# EAGLE design esp-12-f-breakout-ch340t (EAGLE 7.5.0)
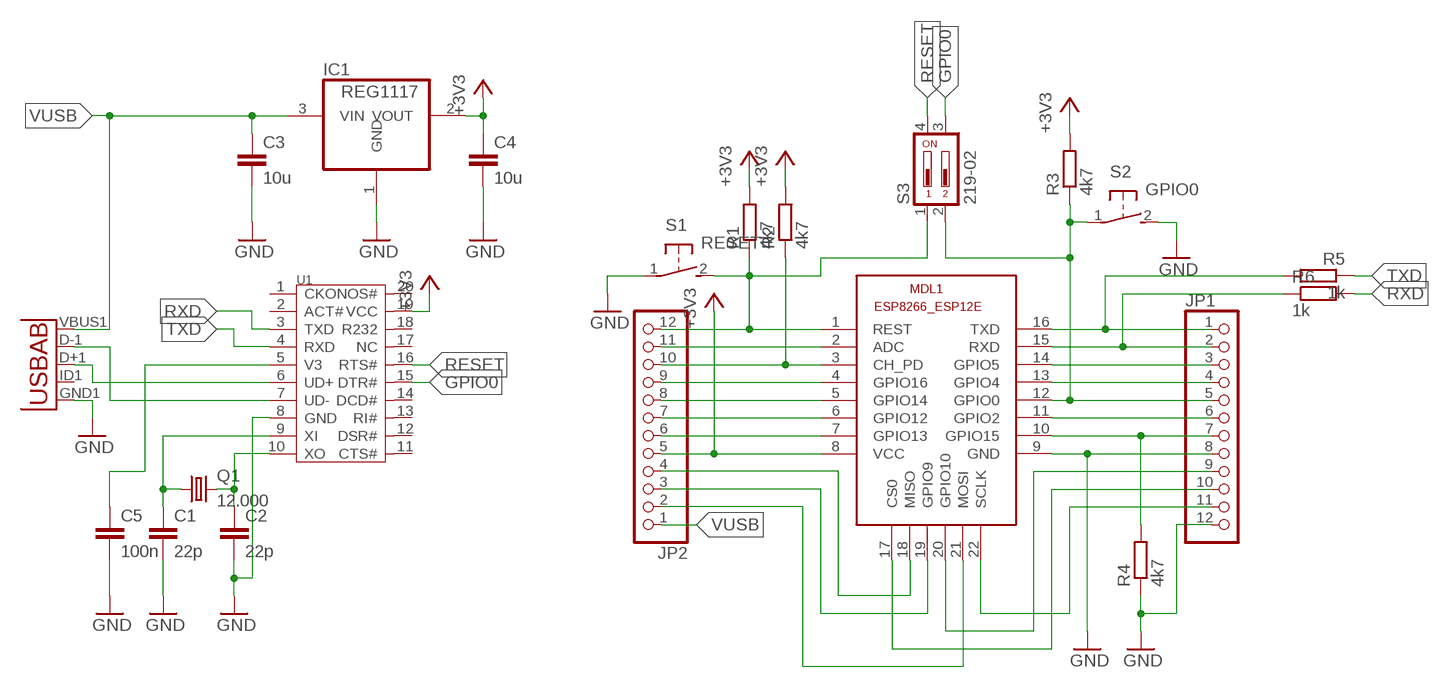
[diagram p0: schematic, sheet 1]

## Parts
C1  22p  C-EUC0805  [C0805]
C2  22p  C-EUC0805  [C0805]
C3  10u  C-EUC0805  [C0805]
C4  10u  C-EUC0805  [C0805]
C5  100n  C-EUC0805  [C0805]
IC1  REG1117  [SOT223]
JP1  PINHD-1X12  [1X12]
JP2  PINHD-1X12  [1X12]
MDL1  ESP8266-12EESP8266-ESP12E  [ESP8266-ESP12E]
Q1  12.000  CRYSTALHC49UP  [HC49UP]
R1  4k7  R-EU_M0805  [M0805]
R2  4k7  R-EU_M0805  [M0805]
R3  4k7  R-EU_M0805  [M0805]
R4  4k7  R-EU_M0805  [M0805]
R5  1k  R-EU_M0805  [M0805]
R6  1k  R-EU_M0805  [M0805]
S1  RESET  DTSM-3  [DTSM-3]
S2  GPIO0  DTSM-3  [DTSM-3]
S3  219-02  [CTS-219-02]
U1  CH340T  [SSOP20]
U2  USB""  [USB-MICRO-SMD]

## Nets
+3V3: C4.1 IC1.2(VOUT) JP2.5 MDL1.8(VCC) R1.2 R2.2 R3.2 U1.19(VCC)
GND: C1.2 C2.2 C3.2 C4.2 C5.2 IC1.1(GND) JP1.8 JP1.12 MDL1.9(GND) R4.1 S1.1 S2.2 U1.8(GND) U2.GND1(GND)
GPIO0: S3.3 U1.15(DTR#)
N$1: JP2.12 MDL1.1(REST) R1.1 S1.2 S3.1
N$2: JP2.11 MDL1.2(ADC)
N$3: JP2.10 MDL1.3(CH_PD) R2.1
N$4: JP2.9 MDL1.4(GPIO16)
N$5: JP2.8 MDL1.5(GPIO14)
N$6: JP2.7 MDL1.6(GPIO12)
N$7: JP2.6 MDL1.7(GPIO13)
N$8: JP2.4 MDL1.18(MISO)
N$11: JP2.3 MDL1.19(GPIO9)
N$12: JP1.9 MDL1.20(GPIO10)
N$13: JP1.10 MDL1.17(CS0)
N$14: JP1.11 MDL1.22(SCLK)
N$15: JP2.2 MDL1.21(MOSI)
N$16: JP1.7 MDL1.10(GPIO15) R4.2
N$17: JP1.6 MDL1.11(GPIO2)
N$18: JP1.5 MDL1.12(GPIO0) R3.1 S2.1 S3.2
N$19: JP1.4 MDL1.13(GPIO4)
N$20: JP1.3 MDL1.14(GPIO5)
N$21: JP1.2 MDL1.15(RXD) R6.1
N$22: JP1.1 MDL1.16(TXD) R5.2
N$23: C1.1 Q1.1 U1.9(XI)
N$24: C2.1 Q1.2 U1.10(XO)
N$25: U1.7(UD-) U2.D-1(D-)
N$26: U1.6(UD+) U2.D+1(D+)
RESET: S3.4 U1.16(RTS#)
RXD: R6.2 U1.3(TXD)
TXD: R5.1 U1.4(RXD)
V3: C5.1 U1.5(V3)
VUSB: C3.1 IC1.3(VIN) JP2.1 U2.VBUS1(VBUS)
Unconnected: U1.1(CKO) U1.2(ACT#) U1.11(CTS#) U1.12(DSR#) U1.13(RI#) U1.14(DCD#) U1.17(NC) U1.18(R232) U1.20(NOS#) U2.ID1(USBID)

## Library data of the parts
C1-C5 = rcl:C-EU: CAPACITOR, European symbol
IC1 = burr-brown:REG1117: 800mA and 1A Low Dropout (LDO) Positive Regulator 1.8V, 2.5V, 2.85V, 3.3V, 5V, and Adj; MPN: REG1117; OC_FARNELL: 1097566; OC_NEWARK: 14P6981
JP1 JP2 = pinhead:PINHD-1X12: PIN HEADER
MDL1 = ESP8266-ESP12E:ESP8266-12E: ESP8266-12E with additional I/O and GPIO04/05 corrected The author cannot warrant that this library is free from error or will meet your specific requirements. Created by PuceBaboon.com. Komagane, Nagano, JAPAN
Q1 = crystal:CRYSTAL: CRYSTAL; OC_FARNELL: unknown; OC_NEWARK: unknown
R1-R6 = rcl:R-EU_: RESISTOR, European symbol
S1 S2 = switch-tact:DTSM-3
S3 = switch-dil:219-02*: Surface Mount DIP Switch Series 219 SMT CTS Electronic Components Sourc: www.ctscorp.com; OC_FARNELL: unknown; OC_NEWARK: unknown
U1 = template:CH340T
U2 = MicroUSB:USB: This is a USB AB connector that is compatible with USB OTG. i.e. this connector can serve as a host or device

## Net classes
0 default: width 0.305 mm, clearance 0.254 mm

## Board
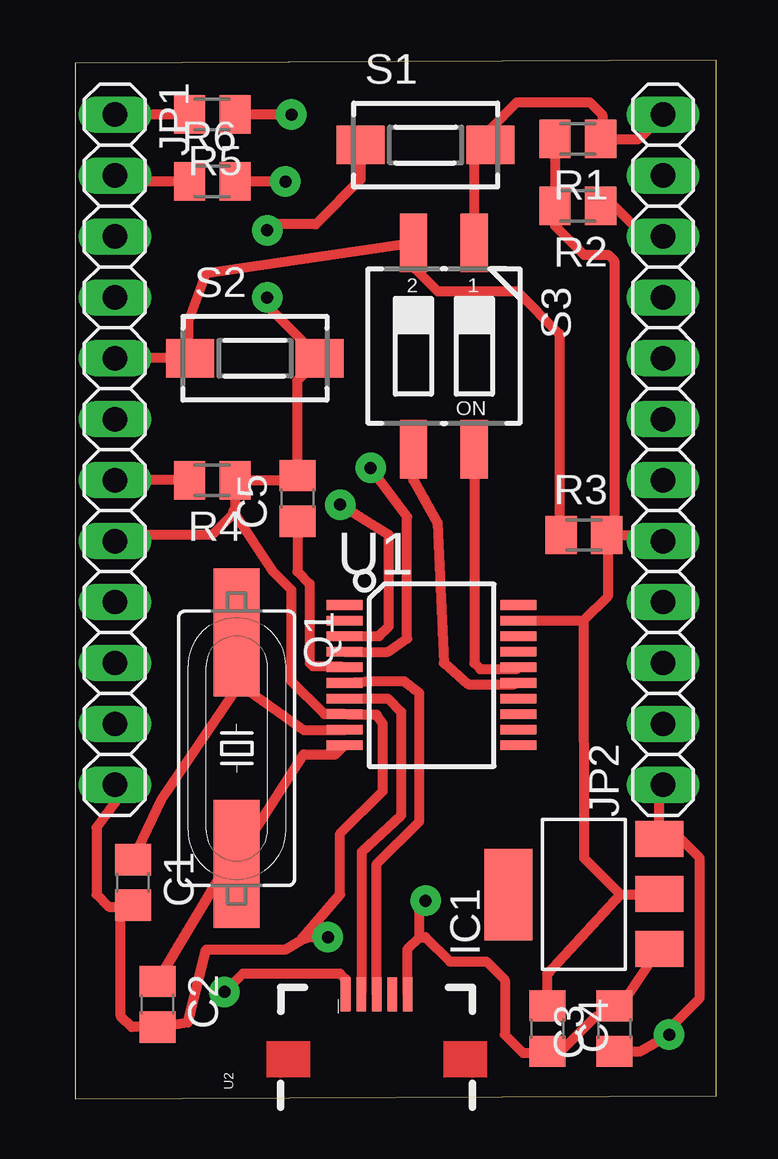
[diagram p1: board, top side]
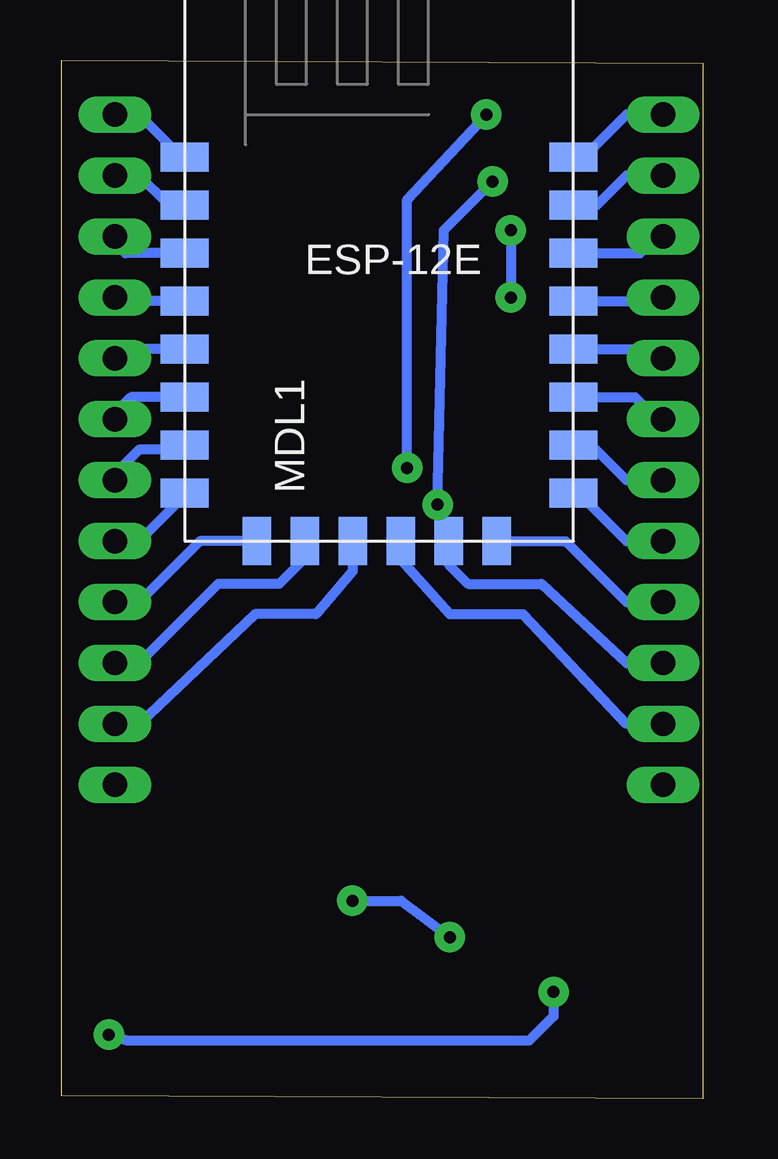
[diagram p2: board, bottom side, seen from below]

Size 26.72 x 43.3 mm. Coordinates in mm from the lower left corner, seen from the top.
Outline: 0,0 26.72,0.13 26.72,43.3 0,43.17 0,0
Copper layers (1*16): Top 0.035mm / dielectric 1.5mm / Bottom 0.035mm
Design rules "default": minimum track width 10mil, minimum drill 24mil, track to track 8mil, track to pad 8mil, pad to pad 8mil, via to via 8mil, smd to smd 8mil, copper to edge 40mil, drill to drill 8mil, minimum pad ring 10mil, minimum via ring 8mil, stop-mask expansion 4mil, vias tented up to drill 0mil, thermal gap 10mil

### Footprints (pad centres in the part's own frame; a part is rotated, then mirrored left to right if it is on the bottom)
C0805 = smd 1.3 x 1.5: 1 -0.95,0; 2 0.95,0
SOT223 = smd 1.499 x 2.007: 1 -2.261,-3.15; 2 0.025,-3.15; 3 2.311,-3.15 | smd 3.81 x 2.007: 4 0,3.15
1X12 = drill 1.016 long: 1 -13.97,0; 2 -11.43,0; 3 -8.89,0; 4 -6.35,0; 5 -3.81,0; 6 -1.27,0; 7 1.27,0; 8 3.81,0; 9 6.35,0; 10 8.89,0; 11 11.43,0; 12 13.97,0
ESP8266-ESP12E = smd 2 x 1.2: 1 0,16; 2 0,14; 3 0,12; 4 0,10; 5 0,8; 6 0,6; 7 0,4; 8 0,2; 9 16.2,2; 10 16.2,4; 11 16.2,6; 12 16.2,8; 13 16.2,10; 14 16.2,12; 15 16.2,14; 16 16.2,16 | smd 1.2 x 2: 17 11,0; 18 3,0; 19 5,0; 20 13,0; 21 7,0; 22 9,0
HC49UP = smd 5.334 x 1.93: 1 -4.826,0; 2 4.826,0
M0805 = smd 1.3 x 1.6: 1 -0.95,0; 2 0.95,0
DTSM-3 = smd 2 x 1.6: 1 -2.7,0; 2 2.7,0
CTS-219-02 = smd 1.13 x 2.44: 1 -1.27,-4.3; 2 1.27,-4.3; 3 1.27,4.3; 4 -1.27,4.3
SSOP20 = smd 0.4 x 1.5: 1 -2.925,-3.625; 2 -2.275,-3.625; 3 -1.625,-3.625; 4 -0.975,-3.625; 5 -0.325,-3.625; 6 0.325,-3.625; 7 0.975,-3.625; 8 1.625,-3.625; 9 2.275,-3.625; 10 2.925,-3.625; 11 2.925,3.625; 12 2.275,3.625; 13 1.625,3.625; 14 0.975,3.625; 15 0.325,3.625; 16 -0.325,3.625; 17 -0.975,3.625; 18 -1.625,3.625; 19 -2.275,3.625; 20 -2.925,3.625
USB-MICRO-SMD = smd 1.4 x 0.4: D+1 2.7,0; D-1 2.7,0.65; GND1 2.7,-1.3; ID1 2.7,-0.65; VBUS1 2.7,1.3

### Placement (x,y rotation side)
C1  2.41,9.02 270 top
C2  3.43,3.94 270 top
C3  22.48,2.92 90 top
C4  19.68,2.92 270 top
C5  9.27,25.02 90 top
IC1  21.21,8.51 90 top
JP1  1.65,27.05 270 top
JP2  24.51,27.05 90 top
MDL1  21.59,23.24 0 bottom
Q1  6.73,14.61 270 top
R1  20.96,40.01 180 top
R2  20.96,37.21 180 top
R3  21.21,23.49 0 top
R4  5.71,25.78 180 top
R5  5.71,41.02 180 top
R6  5.71,38.23 0 top
S1  14.61,39.75 0 top
S2  7.49,30.86 0 top
S3  15.37,31.37 180 top
U1  14.86,17.65 270 top
U2  12.57,1.65 90 top
U$1  [MITSUDOMOE]  13.21,14.61 0 bottom

### Tracks (layer width: path | path; a pad name or v marks a point on that pad's centre or on a via)
+3V3
  Top 0.406: R3.2 24.51,23.49 JP2.5 | R1.2 R2.2 20,36.38 21.21,35.18 22.23,35.18 22.48,34.93 22.48,23.81 R3.2 | U1.19 21.2,19.93 | 21.2,19.93 22.23,20.95 22.23,23.43 R3.2 | 21.2,19.93 21.2,15.36 21.21,14.35 21.21,10.03 22.73,8.51 | C4.1 19.68,5.21 22.73,8.51 | 22.73,8.51 24.33,8.51 IC1.2
  Bottom 0.406: MDL1.8 21.59,25.15 23.5,23.24 JP2.5
GND  (via drill 0.5 pad 1.27)
  Top 0.406: 14.35,6.73 13.84,6.22 13.84,4.38 U2.GND1 | 9.4,6.6 8.76,6.22 5.46,6.22 4.7,3.17 C2.2 2.35,2.99 1.91,3.43 1.91,7.56 C1.2 2.09,8 1.4,8 0.89,8.51 0.89,11.3 1.65,12.32 JP1.12 | 9.4,6.6 11.05,8.51 11.05,11.05 12.83,12.83 12.83,15.62 12.57,16 11.39,16 U1.8 10.39,16.03 9.02,17.4 9.02,21.21 8.25,21.97 6.73,24.26 6.6,24.51 6.67,24.45 | S1.1 11.9,38.32 10.03,36.45 8.25,36.45 v8,36.2 | v8,33.4 8,33.05 S2.2 9.27,29.94 C5.2 9.08,25.78 R4.1 6.67,24.45 | 6.67,24.45 5.71,23.49 1.91,23.49 JP1.8 | 14.35,6.73 14.35,8 v14.61,8.26 | v10.54,6.73 9.78,6.73 9.4,6.6 | C4.2 20.26,1.97 | 20.26,1.97 21.72,3.43 22.04,3.43 C3.2 22.74,3.87 IC1.1 | 14.35,6.73 14.61,6.73 15.62,5.71 17.14,5.71 17.91,4.95 17.91,2.67 18.67,1.91 20.19,1.91 20.26,1.97
  Bottom 0.406: MDL1.9 5.17,25.24 3.17,23.24 JP1.8 | v8,36.2 v8,33.4 | v14.61,8.26 12.57,8.26 v10.54,6.73
GPIO0
  Top 0.406: S3.3 14.1,25.78 15.11,24 15.37,18.16 16.38,17.27 18.3,17.27 U1.15
N$1
  Top 0.406: S3.1 16.64,39.08 S1.2 17.3,40.42 18.41,41.53 21.46,41.53 21.97,41.02 21.97,40.07 R1.1 23.5,40.01 JP2.12
  Bottom 0.406: MDL1.1 21.71,39.24 23.5,41.02 JP2.12
N$2
  Bottom 0.406: MDL1.2 22.25,37.24 23.5,38.48 JP2.11
N$3
  Top 0.406: R2.1 22.48,37.21 23.75,35.94 JP2.10
  Bottom 0.406: MDL1.3 24.07,35.24 24.51,35.69 JP2.10
N$4
  Bottom 0.406: MDL1.4 24.51,33.24 | 24.51,33.24 24.61,33.24 | JP2.9 24.51,33.24
N$5
  Bottom 0.406: MDL1.5 24.39,31.24 24.51,31.11 JP2.8
N$6
  Bottom 0.406: MDL1.6 23.84,29.24 24.51,28.57 JP2.7
N$7
  Bottom 0.406: MDL1.7 22.04,27.24 22.23,27.05 23.5,27.05 24.51,26.04 JP2.6
N$8
  Bottom 0.406: MDL1.18 20.96,23.24 23.5,20.7 JP2.4
N$11
  Bottom 0.406: MDL1.19 16.59,22.53 17.65,21.46 20.19,21.46 23.5,18.16 JP2.3
N$12
  Bottom 0.406: MDL1.20 5.71,23.24 3.17,20.7 JP1.9
N$13
  Bottom 0.406: MDL1.17 10.59,22.27 9.78,21.46 6.73,21.46 3.17,18.16 JP1.10
N$14
  Bottom 0.406: MDL1.22 12.59,22.5 10.54,20.19 7.49,20.19 3.17,15.62 JP1.11
N$15
  Bottom 0.406: MDL1.21 14.59,21.99 16.13,20.19 18.67,20.19 23.5,15.62 JP2.2
N$16
  Top 0.406: R4.2 JP1.7
  Bottom 0.406: MDL1.10 4.63,27.24 3.17,25.78 JP1.7
N$17
  Bottom 0.406: MDL1.11 2.83,29.24 1.91,28.32 JP1.6
N$18
  Top 0.406: R3.1 20.19,23.56 20.19,31.88 18.41,33.66 15.11,33.66 14.1,34.67 S3.2 5.44,34.4 4.7,32.39 4.7,30.95 S2.1 JP1.5
  Bottom 0.406: MDL1.12 2.29,31.24 1.91,30.86 JP1.5
N$19
  Bottom 0.406: MDL1.13 2.06,33.24 1.91,33.4 JP1.4
N$20
  Bottom 0.406: MDL1.14 2.61,35.24 1.91,35.94 JP1.3
N$21
  Top 0.406: R6.1 1.91,38.23 JP1.2
  Bottom 0.406: MDL1.15 4.42,37.24 3.17,38.48 JP1.2
N$22
  Top 0.406: R5.2 JP1.1
  Bottom 0.406: MDL1.16 4.96,39.24 3.17,41.02 JP1.1
N$23
  Top 0.406: Q1.1 6.73,17.4 6.86,17.27 | 6.86,17.27 9.53,15.37 U1.9 | C1.1 3.62,12.51 6.86,17.27
N$24
  Top 0.406: U1.10 10.86,14.35 9.53,14.35 7.24,10.79 Q1.2 6.16,9.46 C2.1
N$25
  Top 0.406: U1.7 13.04,16.68 13.59,16.13 13.59,11.81 11.94,10.29 11.94,4.49 U2.D-1
N$26
  Top 0.406: U2.D+1 12.57,9.78 14.35,11.56 14.35,16.89 13.72,17.4 12.45,17.4 U1.6
RESET
  Top 0.406: S3.4 16.64,18.16 16.89,17.91 18.41,17.91 U1.16
RXD  (via drill 0.5 pad 1.27)
  Top 0.406: U1.3 12.67,19.28 13.08,19.68 13.08,23.49 v11.05,24.77 | v8.76,38.23 R6.2
  Bottom 0.406: v11.05,24.77 10.79,36.2 v8.76,38.23
TXD  (via drill 0.5 pad 1.27)
  Top 0.406: 6.99,40.77 6.73,41.02 R5.1 v9.02,41.02 | U1.4 13.04,18.63 13.84,19.18 13.84,24.26 v12.32,26.29
  Bottom 0.406: v12.32,26.29 12.32,37.47 v9.02,41.02
V3
  Top 0.406: C5.1 9.27,21.97 9.78,21.46 9.78,18.16 9.91,18.03 11.04,18.03 U1.5
VUSB  (via drill 0.5 pad 1.27)
  Top 0.406: U2.VBUS1 11.27,4.98 11.05,5.21 6.99,5.21 v6.22,4.44 | C3.1 23.56,1.97 v24.77,2.67 24.51,2.67 26.04,4.19 26.04,10.03 24.77,11.3 24.77,11.23 IC1.3 24.36,12.93 JP2.1
  Bottom 0.406: v6.22,4.44 6.22,3.43 7.24,2.41 24,2.41 v24.77,2.67